# Altium schematic sheet FPGA_Board_for_Generator__3V3_to_5V_Conv.SchDoc
size B; Organization: Altium Limited; Address1: L3, 12a Rodborough Rd; Address2: Frenchs Forest; Address3: NSW; Address4: Australia 2086; DocumentNumber: 4; SheetNumber: 3; SheetTotal: 21
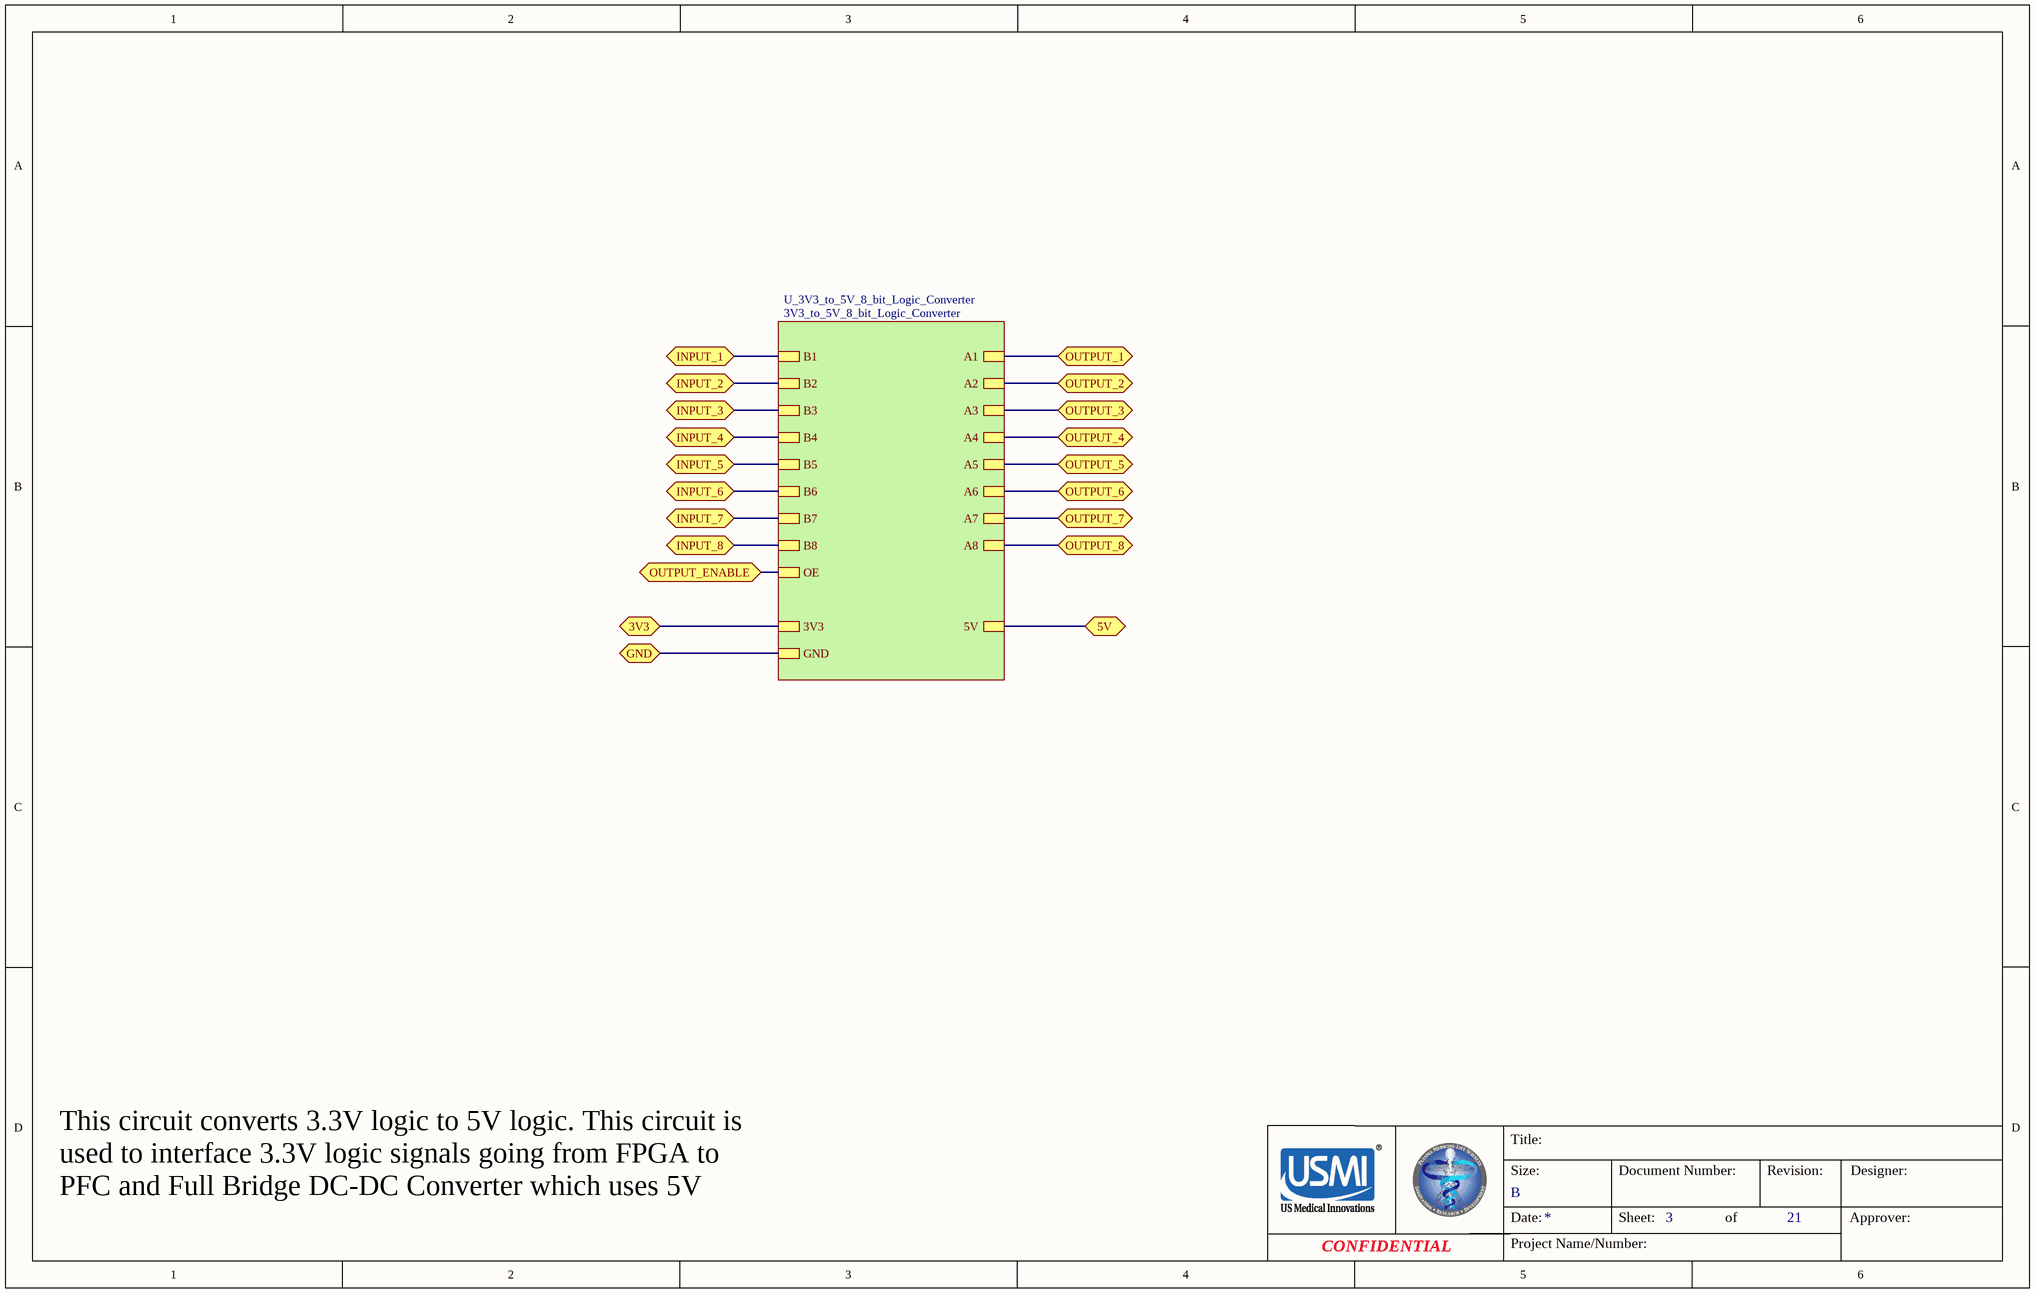
[diagram p0: FPGA_Board_for_Generator__3V3_to_5V_Conv.SchDoc]

## Sub-sheets
U_3V3_to_5V_8_bit_Logic_Converter = 3V3_to_5V_8_bit_Logic_Converter: A1, A2, A3, A4, A5, A6, A7, A8, B1, B2, B3, B4, B5, B6, B7, B8, OE, 5V, 3V3, GND

## Ports
3V3, 5V, GND, INPUT_1, INPUT_2, INPUT_3, INPUT_4, INPUT_5, INPUT_6, INPUT_7, INPUT_8, OUTPUT_1, OUTPUT_2, OUTPUT_3, OUTPUT_4, OUTPUT_5, OUTPUT_6, OUTPUT_7, OUTPUT_8, OUTPUT_ENABLE

## Nets
3V3: port 3V3, sheet U_3V3_to_5V_8_bit_Logic_Converter/3V3
5V: port 5V, sheet U_3V3_to_5V_8_bit_Logic_Converter/5V
GND: port GND, sheet U_3V3_to_5V_8_bit_Logic_Converter/GND
INPUT_1: port INPUT_1, sheet U_3V3_to_5V_8_bit_Logic_Converter/B1
INPUT_2: port INPUT_2, sheet U_3V3_to_5V_8_bit_Logic_Converter/B2
INPUT_3: port INPUT_3, sheet U_3V3_to_5V_8_bit_Logic_Converter/B3
INPUT_4: port INPUT_4, sheet U_3V3_to_5V_8_bit_Logic_Converter/B4
INPUT_5: port INPUT_5, sheet U_3V3_to_5V_8_bit_Logic_Converter/B5
INPUT_6: port INPUT_6, sheet U_3V3_to_5V_8_bit_Logic_Converter/B6
INPUT_7: port INPUT_7, sheet U_3V3_to_5V_8_bit_Logic_Converter/B7
INPUT_8: port INPUT_8, sheet U_3V3_to_5V_8_bit_Logic_Converter/B8
OUTPUT_1: port OUTPUT_1, sheet U_3V3_to_5V_8_bit_Logic_Converter/A1
OUTPUT_2: port OUTPUT_2, sheet U_3V3_to_5V_8_bit_Logic_Converter/A2
OUTPUT_3: port OUTPUT_3, sheet U_3V3_to_5V_8_bit_Logic_Converter/A3
OUTPUT_4: port OUTPUT_4, sheet U_3V3_to_5V_8_bit_Logic_Converter/A4
OUTPUT_5: port OUTPUT_5, sheet U_3V3_to_5V_8_bit_Logic_Converter/A5
OUTPUT_6: port OUTPUT_6, sheet U_3V3_to_5V_8_bit_Logic_Converter/A6
OUTPUT_7: port OUTPUT_7, sheet U_3V3_to_5V_8_bit_Logic_Converter/A7
OUTPUT_8: port OUTPUT_8, sheet U_3V3_to_5V_8_bit_Logic_Converter/A8
OUTPUT_ENABLE: port OUTPUT_ENABLE, sheet U_3V3_to_5V_8_bit_Logic_Converter/OE

## Notes on the sheet
- Title:
- Size:
- Document Number:
- Revision:
- Designer:
- This circuit converts 3.3V logic to 5V logic. This circuit is used to interface 3.3V logic signals going from FPGA to PFC and Full Bridge DC-DC Converter which uses 5V logic.
- Date:
- Project Name/Number:
- B
- Sheet:
- of
- Approver:
- CONFIDENTIAL